# EAGLE design PongSat_Sen3 (EAGLE 6.2)
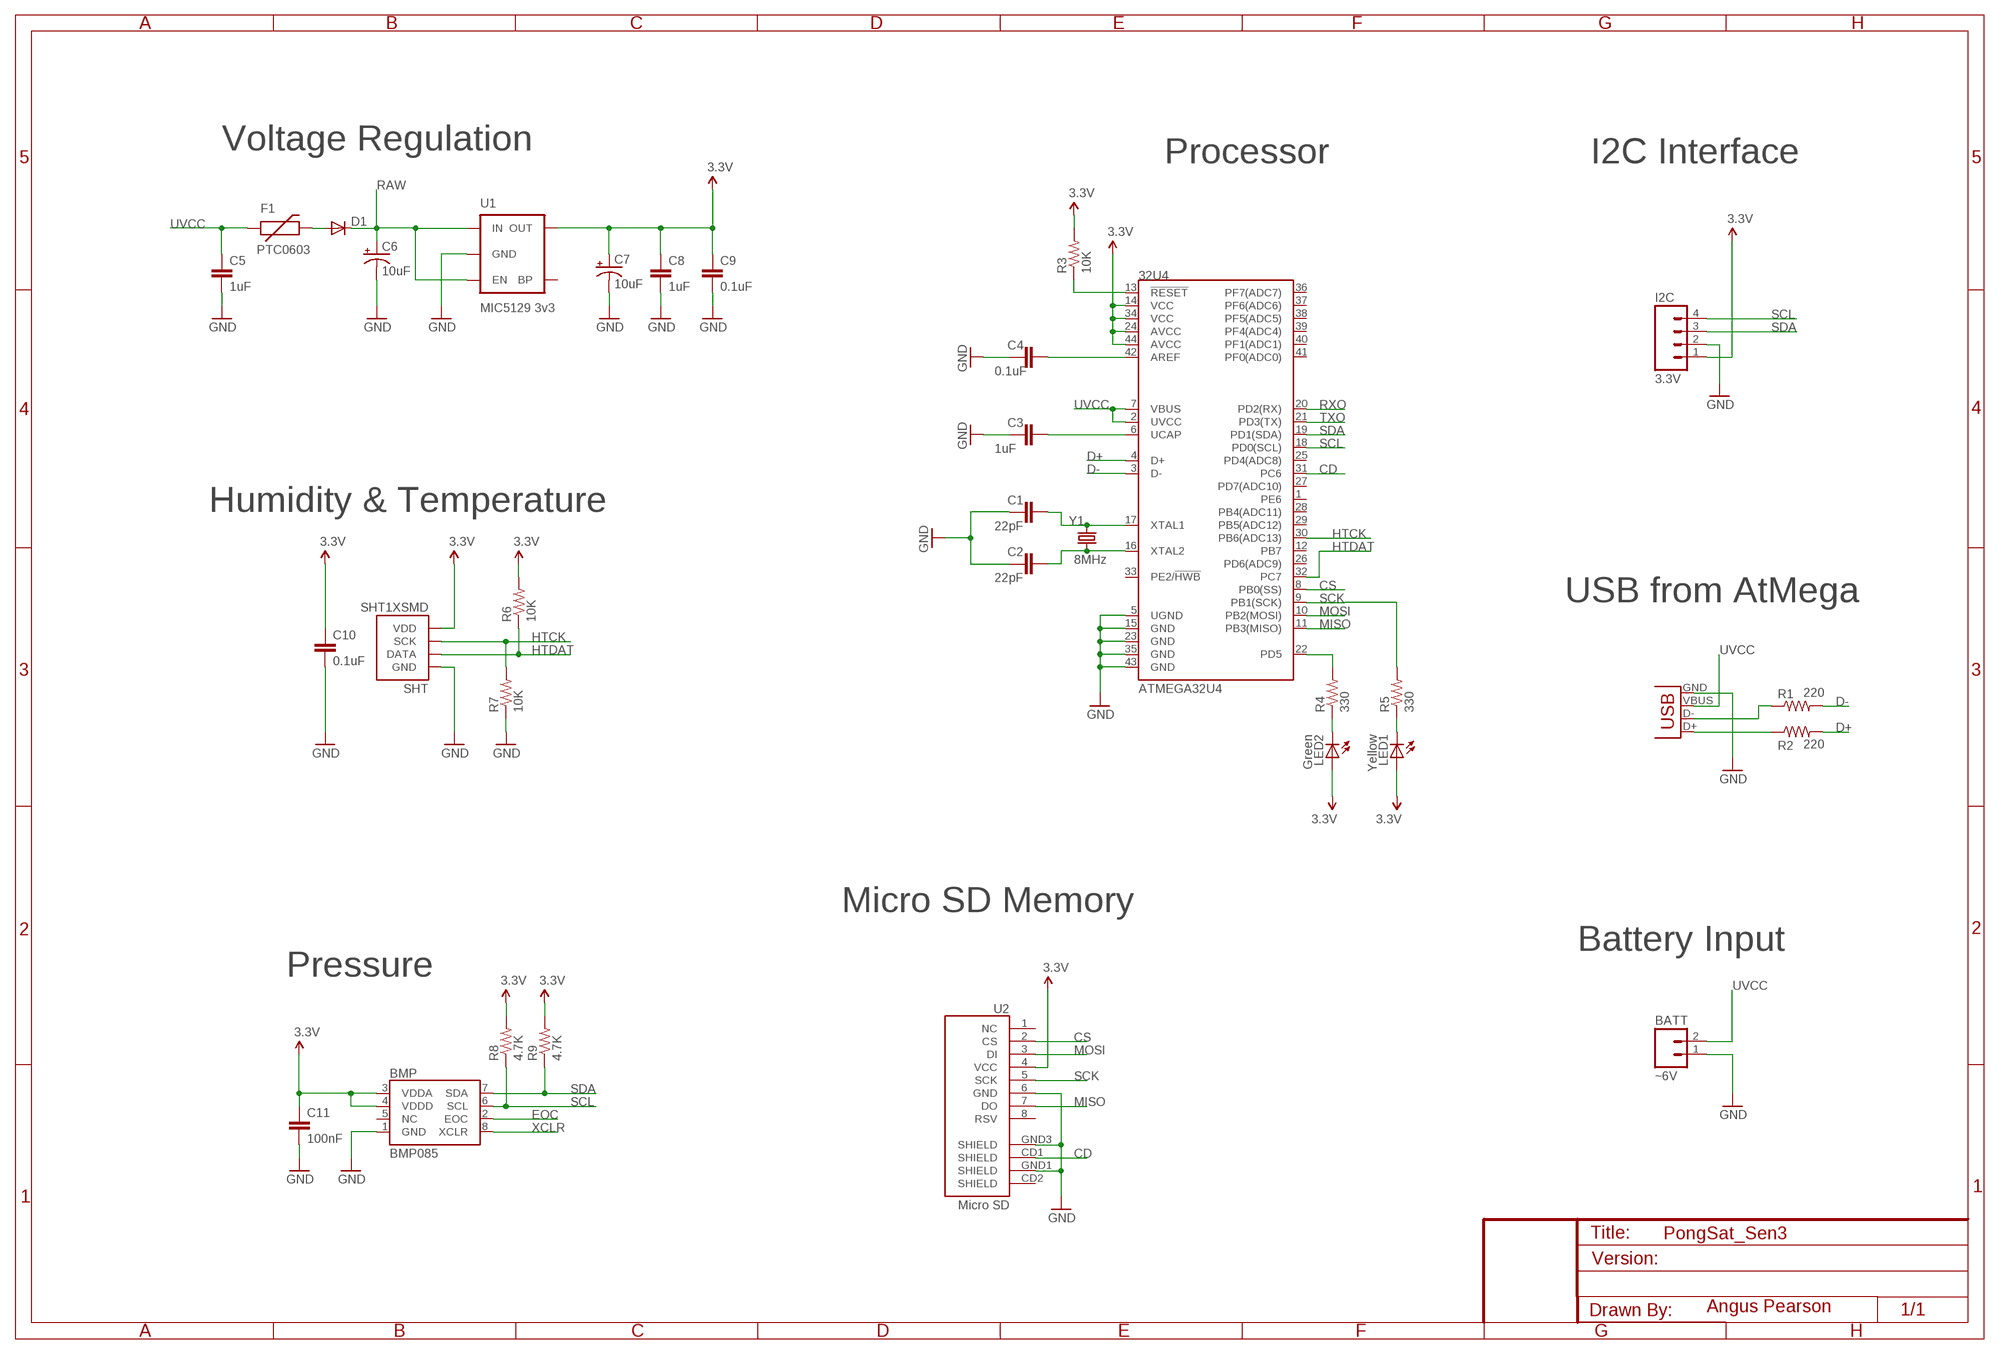
[diagram p0: schematic, sheet 1]

## Parts
32U4  ATMEGA32U4  ATMEGA32U4QFN2  [QFN-44-NOPAD]
BATT  ~6V  M02PTH  [1X02]
BMP  BMP085  [BMP085]
C1  22pF  CAP0402-CAP  [0402-CAP]
C2  22pF  CAP0402-CAP  [0402-CAP]
C3  1uF  CAP0402-CAP  [0402-CAP]
C4  0.1uF  CAP0402-CAP  [0402-CAP]
C5  1uF  CAP0402-CAP  [0402-CAP]
C6  10uF  CAP_POL1206-KIT  [EIA3216-KIT]
C7  10uF  CAP_POL1206-KIT  [EIA3216-KIT]
C8  1uF  CAP0402-CAP  [0402-CAP]
C9  0.1uF  CAP0402-CAP  [0402-CAP]
C10  0.1uF  CAP0402-CAP  [0402-CAP]
C11  100nF  CAP0402-CAP  [0402-CAP]
D1  DIODESOT23  [SOT23-3]
F1  PTC0603  [0603]
I2C  3.3V  M04SMD  [1X04-SMD]
LED1  Yellow  LED0603  [LED-0603]
LED2  Green  LED0603  [LED-0603]
R1  220  RESISTOR0402-RES  [0402-RES]
R2  220  RESISTOR0402-RES  [0402-RES]
R3  10K  RESISTOR0402-RES  [0402-RES]
R4  330  RESISTOR0402-RES  [0402-RES]
R5  330  RESISTOR0402-RES  [0402-RES]
R6  10K  RESISTOR0402-RES  [0402-RES]
R7  10K  RESISTOR0402-RES  [0402-RES]
R8  4.7K  RESISTOR0402-RES  [0402-RES]
R9  4.7K  RESISTOR0402-RES  [0402-RES]
SHT  SHT1XSMD  [SHT1X]
U1  MIC5129 3v3  V_REG_MIC5219SMD  [SOT23-5]
U2  Micro SD  USD-SOCKETNEW  [MICRO-SD-SOCKET-PP]
X1  USB-MICROB  [USB-MICROB]
Y1  8MHz  CRYSTAL5X3  [CRYSTAL-SMD-5X3]

## Nets
3.3V: 32U4.14(VCC) 32U4.24(AVCC) 32U4.34(VCC) 32U4.44(AVCC) BMP.3(VDDA) BMP.4(VDDD) C7.A(+) C8.1 C9.1 C10.1 C11.1 I2C.1 LED1.A LED2.A R3.2 R6.2 R8.2 R9.2 SHT.4(VDD) U1.5(OUT) U2.4(VCC)
CD: 32U4.31(PC6) U2.CD1(SHIELD)
CS: 32U4.8(PB0(SS)) U2.2(CS)
D+: 32U4.4(D+) R2.2
D-: 32U4.3(D-) R1.2
EOC: BMP.2(EOC)
GND: 32U4.5(UGND) 32U4.15(GND) 32U4.23(GND) 32U4.35(GND) 32U4.43(GND) BATT.1 BMP.1(GND) C1.1 C2.1 C3.1 C4.1 C5.2 C6.C(-) C7.C(-) C8.2 C9.2 C10.2 C11.2 I2C.2 R7.1 SHT.1(GND) U1.2(GND) U2.6(GND) U2.GND1(SHIELD) U2.GND3(SHIELD) X1.GND
HTCK: 32U4.30(PB6(ADC13)) R7.2 SHT.3(SCK)
HTDAT: 32U4.32(PC7) R6.1 SHT.2(DATA)
MISO: 32U4.11(PB3(MISO)) U2.7(DO)
MOSI: 32U4.10(PB2(MOSI)) U2.3(DI)
N$1: 32U4.16(XTAL2) C2.2 Y1.1
N$2: 32U4.17(XTAL1) C1.2 Y1.3
N$3: R1.1 X1.D-
N$4: R2.1 X1.D+
N$5: 32U4.6(UCAP) C3.2
N$6: LED2.C R4.1
N$7: LED1.C R5.1
N$15: 32U4.13(!RESET) R3.1
N$16: 32U4.42(AREF) C4.2
N$17: D1.1(A) F1.2
RAW: C6.A(+) D1.3(C) U1.1(IN) U1.3(EN)
RXO: 32U4.20(PD2(RX))
SCK: 32U4.9(PB1(SCK)) R5.2 U2.5(SCK)
SCL: 32U4.18(PD0(SCL)) BMP.6(SCL) I2C.4 R8.1
SDA: 32U4.19(PD1(SDA)) BMP.7(SDA) I2C.3 R9.1
TXLED: 32U4.22(PD5) R4.2
TXO: 32U4.21(PD3(TX))
UVCC: 32U4.2(UVCC) 32U4.7(VBUS) BATT.2 C5.1 F1.1 X1.VBUS
XCLR: BMP.8(XCLR)
Unconnected: 32U4.1(PE6) 32U4.12(PB7) 32U4.25(PD4(ADC8)) 32U4.26(PD6(ADC9)) 32U4.27(PD7(ADC10)) 32U4.28(PB4(ADC11)) 32U4.29(PB5(ADC12)) 32U4.33(PE2/!HWB) 32U4.36(PF7(ADC7)) 32U4.37(PF6(ADC6)) 32U4.38(PF5(ADC5)) 32U4.39(PF4(ADC4)) 32U4.40(PF1(ADC1)) 32U4.41(PF0(ADC0)) BMP.5(NC) U1.4(BP) U2.1(NC) U2.8(RSV) U2.CD2(SHIELD)

## Notes on the sheet
- Voltage Regulation
- Processor | I2C Interface
- Humidity & Temperature
- USB from AtMega
- Micro SD Memory
- Battery Input
- Pressure
- Angus Pearson

## Library data of the parts
32U4 = SparkFun-DigitalIC:ATMEGA32U4: Atmel 44-pin 8-bit Microcontroller with 32KBytes of ISP Flash and USB Controller
BATT = SparkFun-Connectors:M02: Header 2 Standard 2-pin 0.1" header. Use with straight break away headers (SKU : PRT-00116), right angle break away headers (PRT-00553), swiss pins (PRT-00743), machine pins (PRT-00117), and female headers (PRT-00115). Molex polarized connector foot print use with SKU : PRT-08233 with associated crimp pins and housings.
BMP = SparkFun-Sensors:BMP085: BMP085 Pressure Sensor Great little MEMS pressure sensor. SKU: COM-09603
C1-C5 C8-C11 = SparkFun-Passives:CAP: Capacitor Standard 0603 ceramic capacitor, and 0.1" leaded capacitor.
C6 C7 = SparkFun-Passives:CAP_POL: Capacitor Polarized These are standard SMD and PTH capacitors. Normally 10uF, 47uF, and 100uF in electrolytic and tantalum varieties. Always verify the external diameter of the through hole cap, it varies with capacity, voltage, and manufacturer. The EIA devices should be standard.
D1 = SparkFun-DiscreteSemi:DIODE: Diode These are standard reverse protection diodes and small signal diodes. SMA package can handle up to about 1A. SOD-323 can handle about 200mA. What the SOD-323 package when ordering, there are some mfgs out there that are 5-pin packages.
F1 = SparkFun-PowerIC:PTC: Resettable Fuse PTC Resettable Fuse. Spark Fun Electronics SKU : COM-08357
I2C = SparkFun-Connectors:M04: Header 4 Standard 4-pin 0.1" header. Use with straight break away headers (SKU : PRT-00116), right angle break away headers (PRT-00553), swiss pins (PRT-00743), machine pins (PRT-00117), and female headers (PRT-00115). Molex polarized connector foot print use with SKU : PRT-08231 with associated crimp pins and housings. 1MM SMD Version SKU: PRT-10208
LED1 LED2 = SparkFun-LED:LED: LEDs Standard schematic elements and footprints for 5mm, 3mm, 1206, and 0603 sized LEDs. 5mm - Spark Fun Electronics SKU : COM-00529 (and others)
R1-R9 = SparkFun-Passives:RESISTOR: Resistor Basic schematic elements and footprints for 0603, 1206, and PTH resistors.
SHT = SparkFun-Sensors:SHT1X: SHT1x Humdity Sensor Sensirion humdity sensor. Schematic element and footprint proven. Spark Fun Electronics SKU : COM-08227
U1 = SparkFun-PowerIC:V_REG_MIC5219: V_REG MIC5219 Standard 500mA LDO voltage regulator in SOT-23 layout. Micrel part MIC5219. BP (by-pass) pin is used to lower output noise with 470pF cap, may be left open.
U2 = SparkFun-Connectors:USD-SOCKET: microSD Socket Push-push type uSD socket. Schematic element and footprint production proven. Spark Fun Electronics SKU : PRT-00127. tDoc lines correctly indicate media card edge positions when inserting (unlocked, locked, depressed).
X1 = SparkFun-Connectors:USB: USB Connectors USB-B-PTH is fully proven SKU : PRT-00139 USB-miniB is fully proven SKU : PRT-00587 USB-A-PCB is untested. USB-A-H is throughly reviewed, but untested. Spark Fun Electronics SKU : PRT-00437 USB-B-SMT is throughly reviewed, but untested. Needs silkscreen touching up. USB-A-S has not been used/tested USB-MB-H has not been used/tested
Y1 = SparkFun-FreqCtrl:CRYSTAL: Various standard crystals. Proven footprints. Spark Fun Electronics SKU : COM-00534

## Board
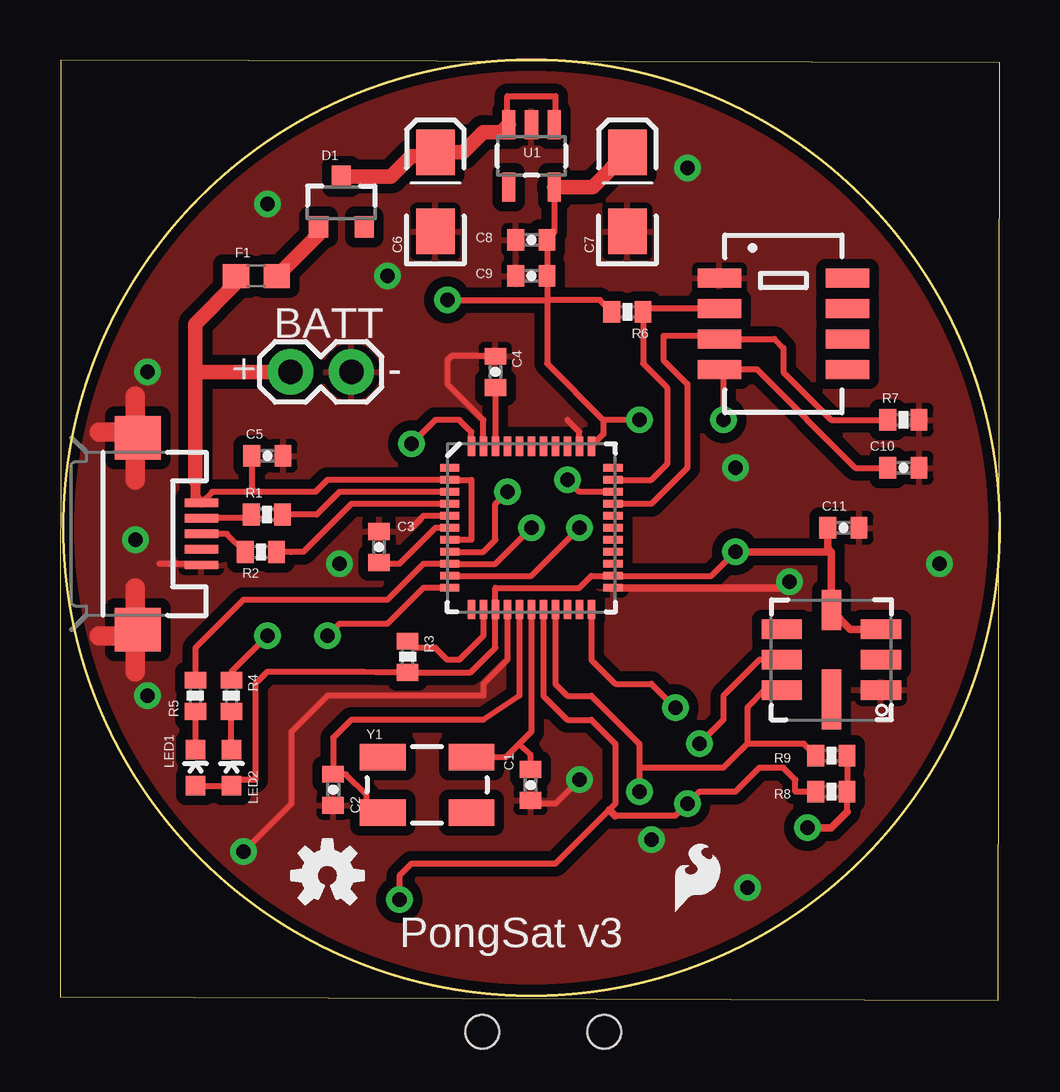
[diagram p1: board, top side]
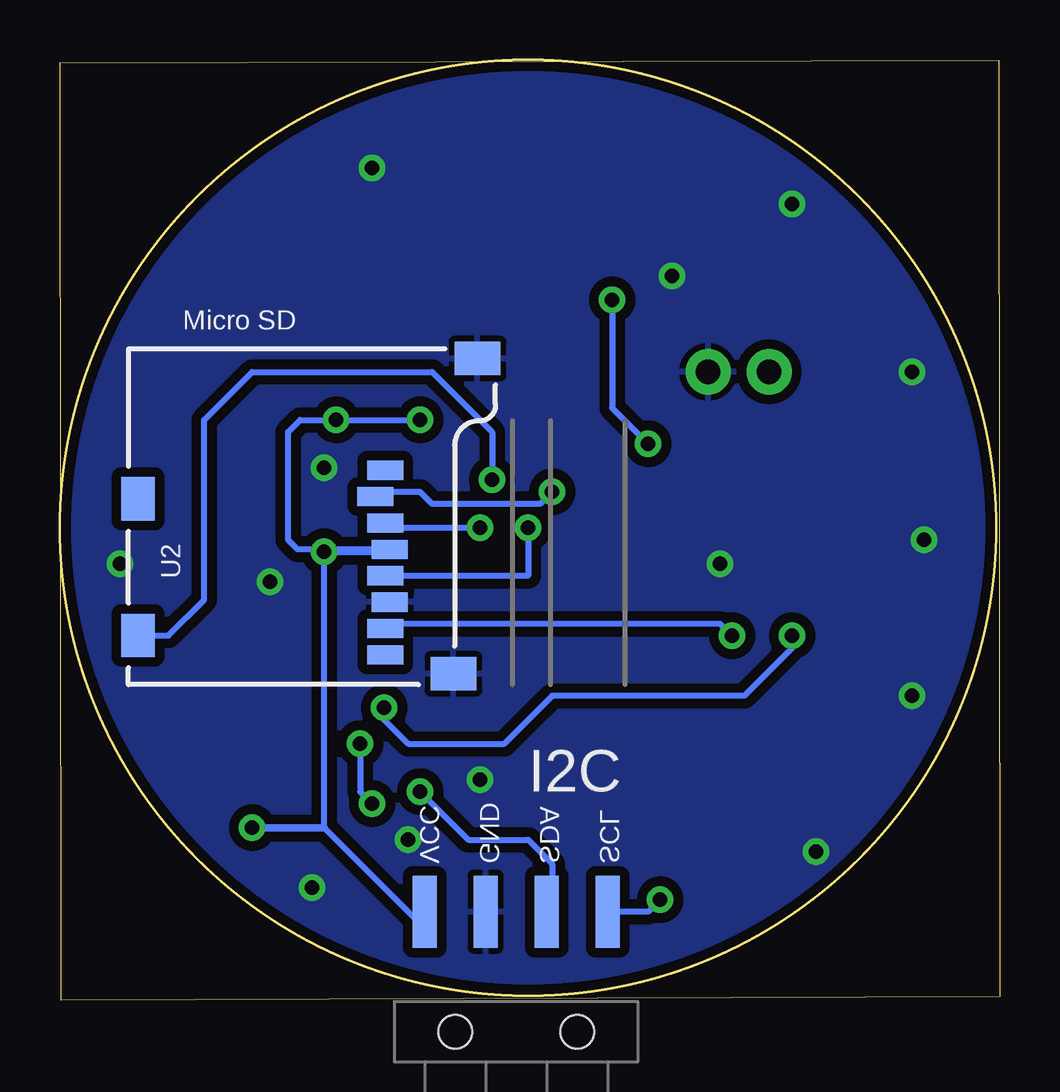
[diagram p2: board, bottom side, seen from below]

Size 39.15 x 39.2 mm. Coordinates in mm from the lower left corner, seen from the top.
Outline: 0,0.14 39.09,0 39.15,39.09 0.04,39.19 0,0.14
Outline: circle at 19.64,19.7 radius 19.5
Copper layers (1*16): Top 0.035mm / dielectric 1.5mm / Bottom 0.035mm
Design rules: minimum track width 8mil, minimum drill 20mil, track to track 8mil, track to pad 8mil, pad to pad 8mil, via to via 8mil, smd to smd 8mil, copper to edge 10mil, drill to drill 8mil, minimum pad ring 12mil, minimum via ring 10mil, stop-mask expansion 4mil, vias tented up to drill 25mil, thermal gap 10mil

### Footprints (pad centres in the part's own frame; a part is rotated, then mirrored left to right if it is on the bottom)
QFN-44-NOPAD = smd 0.8 x 0.3: 1 -3.4,2.5; 2 -3.4,2; 3 -3.4,1.5; 4 -3.4,1; 5 -3.4,0.5; 6 -3.4,0; 7 -3.4,-0.5; 8 -3.4,-1; 9 -3.4,-1.5; 10 -3.4,-2; 11 -3.4,-2.5; 23 3.4,-2.5; 24 3.4,-2; 25 3.4,-1.5; 26 3.4,-1; 27 3.4,-0.5; 28 3.4,0; 29 3.4,0.5; 30 3.4,1; 31 3.4,1.5; 32 3.4,2; 33 3.4,2.5 | smd 0.3 x 0.8: 12 -2.5,-3.4; 13 -2,-3.4; 14 -1.5,-3.4; 15 -1,-3.4; 16 -0.5,-3.4; 17 0,-3.4; 18 0.5,-3.4; 19 1,-3.4; 20 1.5,-3.4; 21 2,-3.4; 22 2.5,-3.4; 34 2.5,3.4; 35 2,3.4; 36 1.5,3.4; 37 1,3.4; 38 0.5,3.4; 39 0,3.4; 40 -0.5,3.4; 41 -1,3.4; 42 -1.5,3.4; 43 -2,3.4; 44 -2.5,3.4
1X02 = drill 1.016 pad 1.88: 1 0,0; 2 2.54,0
BMP085 = smd 1.67 x 0.8: 1 -2.065,1.27; 2 -2.065,0; 3 -2.065,-1.27; 5 2.065,-1.27; 6 2.065,0; 7 2.065,1.27 | smd 0.8 x 1.67: 4 0,-2.065 | smd 0.8 x 2.5: 8 0,1.65
0402-CAP = smd 0.7 x 0.9: 1 -0.65,0; 2 0.65,0
EIA3216-KIT = smd 1.9 x 1.6: A 1.65,0; C -1.65,0
SOT23-3 = smd 0.8 x 0.9: 1 -0.95,-1; 2 0.95,-1; 3 0,1.1
0603 = smd 1.1 x 1: 1 -0.85,0; 2 0.85,0
1X04-SMD = smd 1 x 3: 1 -3.81,5; 2 -1.27,5; 3 1.27,5; 4 3.81,5 | hole 1.4: -2.54,0; 2.54,0
LED-0603 = smd 0.8 x 0.8: A 0,-0.75; C 0,0.75
0402-RES = smd 0.7 x 0.9: 1 -0.65,0; 2 0.65,0
SHT1X = smd 1.8 x 0.8: 1 -2.667,1.905; 2 -2.667,0.635; 3 -2.667,-0.635; 4 -2.667,-1.905; 5 2.667,-1.905; 6 2.667,-0.635; 7 2.667,0.635; 8 2.667,1.905
SOT23-5 = smd 0.55 x 1.2: 1 -0.95,-1.3; 2 0,-1.3; 3 0.95,-1.3; 4 0.95,1.3; 5 -0.95,1.3
MICRO-SD-SOCKET-PP = smd 0.8 x 1.5: 1 -8.94,10.7; 2 -7.84,10.3; 3 -6.74,10.7; 4 -5.64,10.9; 5 -4.54,10.7; 6 -3.44,10.9; 7 -2.34,10.7; 8 -1.24,10.7 | smd 1.8 x 1.4: CD1 -2.05,0.4; CD2 -7.75,0.4 | smd 1.4 x 1.9: GND1 -13.6,14.55; GND3 -0.45,13.55
USB-MICROB = smd 0.35 x 1.4: D+ 0,2.65; D- -0.65,2.65; GND 1.3,2.65; ID 0.65,2.65; VBUS -1.3,2.65 | smd 1.8 x 1.9: MT1 -4,0; MT2 4,0
CRYSTAL-SMD-5X3 = smd 1.9 x 1.1: 1 -1.85,-1.15; 2 1.85,-1.15; 3 1.85,1.15; 4 -1.85,1.15

### Placement (x,y rotation side)
32U4  19.64,19.7 0 top
BATT  12.14,26.2 180 top
BMP  32.14,14.2 180 top
C1  19.61,8.98 90 top
C2  11.38,8.78 90 top
C3  13.29,18.9 270 top
C4  18.14,26.2 270 top
C5  8.64,22.7 0 top
C6  15.64,33.7 90 top
C7  23.64,33.7 90 top
C8  19.64,31.7 180 top
C9  19.64,30.2 180 top
C10  35.14,22.2 0 top
C11  32.64,19.7 0 top
D1  11.72,33.24 0 top
F1  8.18,30.2 0 top
I2C  20.14,-1.3 0 bottom
LED1  5.64,9.7 0 top
LED2  7.14,9.7 0 top
R1  8.62,20.26 0 top
R2  8.37,18.69 0 top
R3  14.48,14.32 270 top
R4  7.14,12.7 90 top
R5  5.64,12.7 90 top
R6  23.64,28.7 180 top
R7  35.14,24.2 180 top
R8  32.14,8.7 0 top
R9  32.14,10.2 0 top
SHT  30.14,28.2 0 top
U1  19.64,35.2 180 top
U2  36.3,13.16 270 bottom
U$1  [OSHW-LOGO-S]  11.14,5.2 0 top
U$2  [SFE-LOGO-FLAME]  25.64,3.7 0 top
X1  3.24,19.45 270 top
Y1  15.3,8.98 0 top

### Tracks (layer width: path | path; a pad name or v marks a point on that pad's centre or on a via)
3.3V  (via drill 0.6)
  Top 0.254: U1.5 20.59,32 C8.1 C9.1 20.29,29.2 | LED1.A LED2.A 7.39,9.2 8.14,9.2 8.14,13.2 8.64,13.7 12.64,13.7 13.17,13.67 R3.2 17.11,13.67 18.14,14.7 32U4.14 18.14,17.2 21.64,17.2 22.14,17.7 32U4.24 27.14,17.7 v28.14,18.7 | v24.14,24.2 22.64,24.2 | 22.64,24.2 22.64,23.6 32U4.34 | 20.29,29.2 20.29,26.55 22.64,24.2 | 32U4.44 17.14,23.7 16.64,24.2 15.64,24.2 v14.64,23.2 | v16.14,29.2 20.29,29.2 | SHT.4 27.64,26.3 | C10.1 33.14,22.2 29.05,26.3 27.64,26.3 | 27.64,26.3 v27.64,24.2 | 32.79,7.85 R8.2 R9.2 | R6.2 22.49,29.2 20.29,29.2
  Top 0.305: BMP.3 32.94,15.47 BMP.4 32.14,18.7 | 32.14,18.7 v28.14,18.7 | C11.1 31.99,18.85 32.14,18.7 | 32.79,7.85 32.14,7.2 v31.14,7.2
  Top 0.61: U1.5 22.19,33.9 C7.A
  Bottom 0.254: v24.14,24.2 v27.64,24.2 29.14,24.2 29.64,23.7 29.64,19.2 29.24,18.8 U2.4 25.5,18.7 v28.14,18.7 28.14,7.2 24.14,3.2 I2C.1 | v16.14,29.2 16.14,24.7 v14.64,23.2
  Bottom 0.305: v31.14,7.2 28.14,7.2
CD  (via drill 0.6)
  Top 0.254: 32U4.31 21.64,21.2 v21.14,21.7
  Bottom 0.254: U2.CD1 34.63,15.21 33.14,16.7 33.14,24.2 31.14,26.2 23.64,26.2 21.14,23.7 v21.14,21.7
CS  (via drill 0.6)
  Top 0.254: 32U4.8 17.64,18.7 18.14,19.2 18.14,20.7 v18.64,21.2
  Bottom 0.254: v18.64,21.2 19.14,20.7 23.64,20.7 24.14,21.2 25.8,21.2 U2.2
D+
  Top 0.254: 32U4.4 12.14,20.7 10.14,18.7 9.63,18.69 R2.2
D-
  Top 0.254: 32U4.3 11.64,21.2 10.69,20.26 R1.2
GND  (via drill 0.6)
  Top 0.254: 32U4.5 15.14,20.2 14.64,19.7 | 32U4.35 21.64,23.7 21.14,24.2 | 32U4.43 17.64,24.2 16.14,25.7 16.14,26.7 16.29,26.85 C4.1 | 32U4.15 18.64,14.2 17.64,13.2 17.64,12.7 11.14,12.7 9.64,11.2 9.64,8.2 v7.64,6.2 | 6.14,18.2 4.14,18.2 | v21.64,9.2 20.64,8.2 19.64,8.2
  Top 0.305: 32U4.23 30.14,17.2 v30.39,17.45
  Top 0.813: 3.14,23.2 3.14,21.7 | 3.14,15.2 3.14,17.2 | 3.14,15.2 1.64,15.2 | 3.14,15.2 3.14,13.7 | 1.64,23.7 3.14,23.7 3.14,25.2
  other vias: 3.64,26.2 26.14,34.7 13.64,30.2 36.64,18.2 8.64,33.2 3.64,12.7 28.64,4.7 11.64,18.2 24.64,6.7 28.14,22.2 3.14,19.2
  pour Top (isolate 0.406): 0.14,22.7 0.14,17.2 0.64,16.7 0.64,14.7 1.14,14.2 1.14,13.2 1.64,12.7 1.64,11.7 2.14,11.2 2.14,10.7 2.64,10.2 2.64,9.7 3.64,8.7 3.64,8.2 7.64,4.2 8.14,4.2 9.14,3.2 9.64,3.2 10.64,2.2 11.14,2.2 11.64,1.7 12.64,1.7 13.14,1.2 14.14,1.2 14.64,0.7 16.14,0.7 16.64,0.2 22.64,0.2 23.14,0.7 24.64,0.7 25.14,1.2 25.64,1.2 26.14,1.7 28.14,1.7 29.14,2.7 29.64,2.7 31.64,4.7 32.14,4.7 35.14,7.7 35.14,8.2 36.14,9.2 36.14,9.7 37.14,10.7 37.14,11.7 37.64,12.2 37.64,13.2 38.14,13.7 38.14,14.7 38.64,15.2 38.64,16.2 39.14,16.7 39.14,22.7 38.64,23.2 38.64,25.2 38.14,25.7 38.14,26.7 37.64,27.2 37.64,27.7 37.14,28.2 37.14,28.7 36.64,29.2 36.64,29.7 36.14,30.2 36.14,30.7 30.64,36.2 30.14,36.2 29.64,36.7 29.14,36.7 28.64,37.2 28.14,37.2 27.64,37.7 27.14,37.7 26.64,38.2 25.64,38.2 25.14,38.7 23.14,38.7 22.64,39.2 16.14,39.2 15.64,38.7 14.64,38.7 14.14,38.2 13.14,38.2 12.64,37.7 12.14,37.7 11.64,37.2 9.64,37.2 9.14,36.7 8.64,36.7 1.64,29.7 1.64,29.2 2.14,28.7 2.14,27.7 1.64,27.2 1.64,26.7 1.14,26.2 1.14,25.2 0.64,24.7 0.64,23.2
  pour Bottom (isolate 0.254, hatched): 35.14,7.7 35.14,8.2 36.14,9.2
  pour Bottom (isolate 0.406): 0.14,22.7 0.14,17.2 0.64,16.7 0.64,14.7 1.14,14.2 1.14,13.2 1.64,12.7 1.64,11.7 2.14,11.2 2.14,10.7 2.64,10.2 2.64,9.7 3.64,8.7 3.64,8.2 7.64,4.2 8.14,4.2 9.14,3.2 9.64,3.2 10.64,2.2 11.14,2.2 11.64,1.7 12.64,1.7 13.14,1.2 14.14,1.2 14.64,0.7 16.14,0.7 16.64,0.2 22.64,0.2 23.14,0.7 24.64,0.7 25.14,1.2 25.64,1.2 26.14,1.7 28.14,1.7 29.14,2.7 29.64,2.7 31.64,4.7 32.14,4.7 35.14,7.7 35.14,8.2 36.14,9.2 36.14,9.7 37.14,10.7 37.14,11.7 37.64,12.2 37.64,13.2 38.14,13.7 38.14,14.7 38.64,15.2 38.64,16.2 39.14,16.7 39.14,22.7 38.64,23.2 38.64,25.2 38.14,25.7 38.14,26.7 37.64,27.2 37.64,27.7 37.14,28.2 37.14,28.7 36.64,29.2 36.64,29.7 36.14,30.2 36.14,30.7 30.64,36.2 30.14,36.2 29.64,36.7 29.14,36.7 28.64,37.2 28.14,37.2 27.64,37.7 27.14,37.7 26.64,38.2 25.64,38.2 25.14,38.7 23.14,38.7 22.64,39.2 16.14,39.2 15.64,38.7 14.64,38.7 14.14,38.2 13.14,38.2 12.64,37.7 12.14,37.7 11.64,37.2 9.64,37.2 9.14,36.7 8.64,36.7 1.64,29.7 1.64,29.2 2.14,28.7 2.14,27.7 1.64,27.2 1.64,26.7 1.14,26.2 1.14,25.2 0.64,24.7 0.64,23.2
HTCK
  Top 0.254: 32U4.30 24.64,20.7 26.14,22.2 26.14,25.7 25.14,26.7 25.14,27.7 27.34,27.7 SHT.3 29.78,27.57 30.14,27.2 30.14,26.2 32.14,24.2 R7.2
HTDAT
  Top 0.254: SHT.2 24.43,28.84 R6.1 24.29,26.55 25.29,25.55 25.29,22.35 24.64,21.7 32U4.32
MISO  (via drill 0.6)
  Top 0.254: 32U4.11 15.14,17.2 13.64,15.7 12.64,15.7 11.64,15.7 v11.14,15.2
  Bottom 0.254: v11.14,15.2 11.64,15.7 25.4,15.7 U2.7
MOSI  (via drill 0.6)
  Top 0.254: 32U4.10 19.64,17.7 v21.64,19.7
  Bottom 0.254: v21.64,19.7 25.4,19.7 U2.3
N$1
  Top 0.254: 32U4.16 19.14,12.7 17.64,11.7 12.14,11.7 11.38,10.94 C2.2 11.92,9.43 12.77,8.57 12.77,7.83 | 13.32,7.7 Y1.1 12.77,7.83 | 12.64,7.7 12.77,7.83
N$2
  Top 0.254: 17.18,10.17 Y1.3 | 17.15,10.2 Y1.3 | 19.64,9.63 C1.2 19.61,10.24 19.14,10.7 | 32U4.17 19.64,11.2 19.14,10.7 | 19.14,10.7 18.57,10.13 Y1.3
N$3
  Top 0.254: R1.1 8.32,20.1 X1.D-
N$4
  Top 0.254: R2.1 6.96,19.45 X1.D+
N$5
  Top 0.254: 32U4.6 15.64,19.7 14.14,18.2 13.34,18.2 C3.2
N$6
  Top 0.254: LED2.C R4.1
N$7
  Top 0.254: R5.1 LED1.C
N$15
  Top 0.254: 32U4.13 17.64,15.2 16.64,14.2 16.14,14.2 15.64,14.7 14.75,14.7 R3.1
N$16
  Top 0.254: C4.2 32U4.42
N$17
  Top 0.61: D1.1 10.77,31.94 F1.2
RAW
  Top 0.254: U1.3 18.64,36.55 18.64,37.7 20.64,37.7 20.64,36.5 U1.1
  Top 0.61: D1.3 13.78,34.34 14.64,35.2 15.49,35.2 C6.A 16.79,35.35 17.64,36.2 18.39,36.2 U1.3
SCK  (via drill 0.6)
  Top 0.254: R5.2 5.64,14.7 7.64,16.7 13.64,16.7 15.14,18.2 32U4.9 18.14,18.2 v19.64,19.7
  Bottom 0.254: v19.64,19.7 19.64,17.7 U2.5
SCL  (via drill 0.6)
  Top 0.254: 32U4.18 20.14,12.7 21.14,11.7 22.14,11.7 23.14,10.7 23.14,8.2 22.89,7.95 20.64,5.7 14.64,5.7 14.14,5.2 v14.14,4.2 | BMP.6 29.14,14.2 27.64,12.7 27.64,11.7 v26.64,10.7 | 23.14,7.7 25.64,7.7 v26.14,8.2 26.64,8.7 28.14,8.7 29.14,9.7 30.14,9.7 30.64,9.2 30.64,8.7 R8.1
  Top 0.305: 23.14,7.7 22.89,7.95
  Bottom 0.254: v14.14,4.2 14.64,3.7 I2C.4 16.14,3.89 | v26.64,10.7 26.64,8.7 v26.14,8.2
SDA  (via drill 0.6)
  Top 0.254: 32U4.19 20.64,13.2 21.14,12.7 22.14,12.7 24.14,10.7 24.14,9.7 | 24.14,9.7 v24.14,8.7 | BMP.7 29.37,12.93 28.64,12.2 28.64,10.7 | 28.64,10.7 27.64,9.7 24.14,9.7 | R9.1 30.99,10.7 28.64,10.7
  Bottom 0.254: v24.14,8.7 22.14,6.7 19.64,6.7 18.64,5.7 18.64,3.93 I2C.3
TXLED  (via drill 0.6)
  Top 0.254: R4.2 7.14,13.7 v8.64,15.2 | v25.64,12.2 24.64,13.2 23.14,13.2 22.14,14.2 32U4.22
  Bottom 0.254: v8.64,15.2 8.64,14.7 10.64,12.7 18.64,12.7 20.64,10.7 24.64,10.7 25.64,11.7 v25.64,12.2
UVCC
  Top 0.254: 8.14,21.2 10.64,21.2 11.14,21.7 32U4.2 17.14,21.7 17.14,19.2 32U4.7 | 8.14,21.2 6.34,21.2 X1.VBUS | C5.1 7.99,21.35 8.14,21.2
  Top 0.406: 5.64,21.7 5.64,21 X1.VBUS
  Top 0.61: 5.64,26.2 5.64,28.2 7.33,29.89 F1.1 | 5.64,26.2 5.64,21.7 | BATT.2 5.64,26.2

### Text on the board
tPlace: + | - | PongSat v3
bPlace: I2C | SCL | SDA | GND | VCC